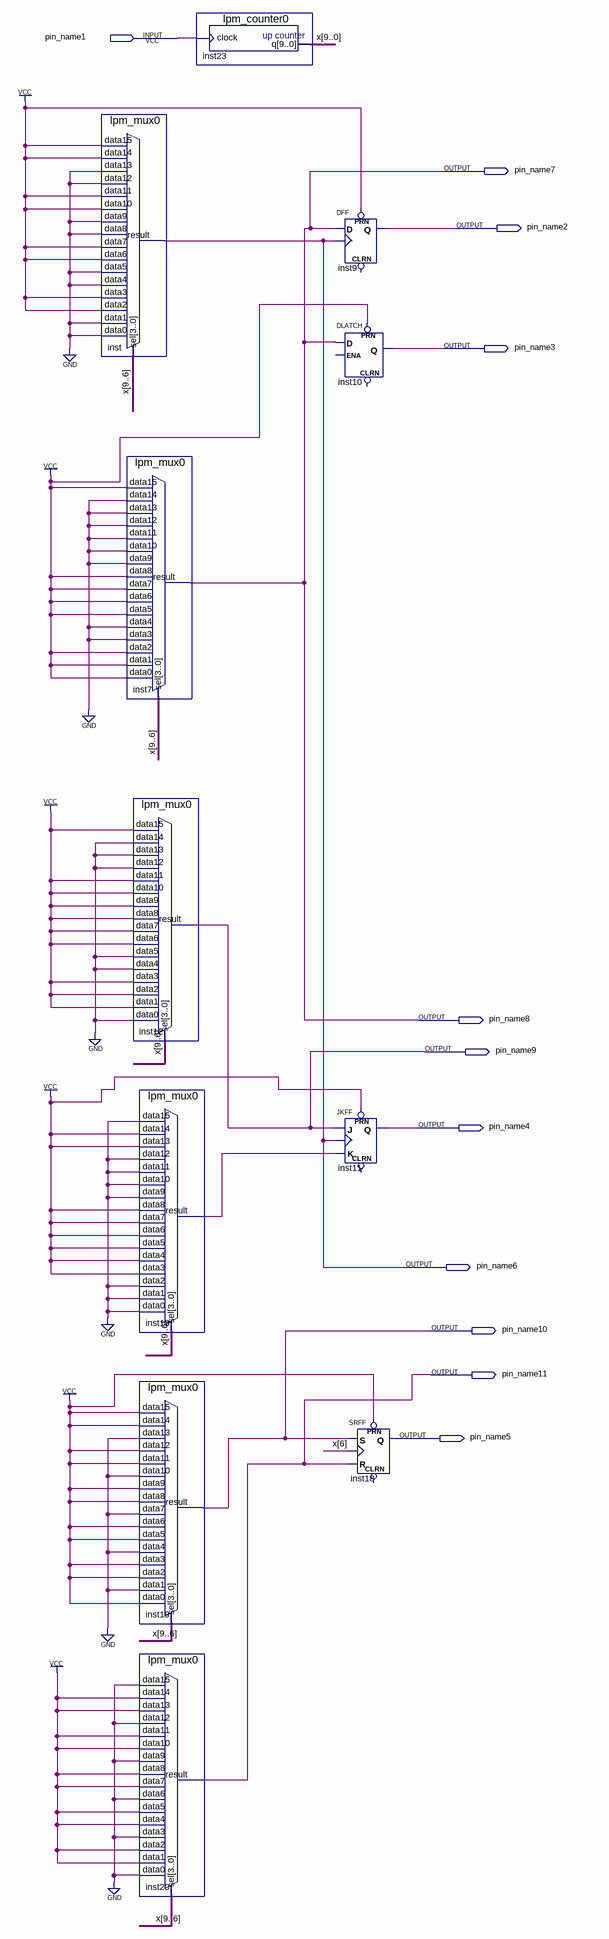
[diagram p0: schematic sheet]
// Quartus schematic Lab_4.bdf as structural Verilog: 11 symbols, 11 pins
module Lab_4 (
  input  pin_name1,
  output pin_name7,
  output pin_name2,
  output pin_name3,
  output pin_name8,
  output pin_name9,
  output pin_name4,
  output pin_name6,
  output pin_name10,
  output pin_name11,
  output pin_name5
);

  wire inst13_result;
  wire [9:0] x;

  lpm_mux0 inst (
    .data15(1'b1), .data14(1'b1), .data13(1'b0), .data12(1'b0), .data11(1'b1), .data10(1'b1), .data9(1'b0),
    .data8(1'b0), .data7(1'b1), .data6(1'b1), .data5(1'b0), .data4(1'b0), .data3(1'b1), .data2(1'b1),
    .data1(1'b0), .data0(1'b0), .sel(x[9:6]), .result(pin_name6));
  lpm_mux0 inst7 (
    .data15(1'b1), .data14(1'b0), .data13(1'b0), .data12(1'b0), .data11(1'b0), .data10(1'b0), .data9(1'b0),
    .data8(1'b1), .data7(1'b1), .data6(1'b1), .data5(1'b1), .data4(1'b0), .data3(1'b0), .data2(1'b1),
    .data1(1'b1), .data0(1'b1), .sel(x[9:6]), .result(pin_name7));
  lpm_mux0 inst12 (
    .data15(1'b1), .data14(1'b0), .data13(1'b0), .data12(1'b0), .data11(1'b1), .data10(1'b1), .data9(1'b1),
    .data8(1'b1), .data7(1'b1), .data6(1'b1), .data5(1'b0), .data4(1'b0), .data3(1'b1), .data2(1'b1),
    .data1(1'b1), .data0(1'b0), .sel(x[9:6]), .result(pin_name9));
  lpm_mux0 inst13 (
    .data15(1'b0), .data14(1'b1), .data13(1'b1), .data12(1'b0), .data11(1'b0), .data10(1'b0), .data9(1'b0),
    .data8(1'b1), .data7(1'b1), .data6(1'b1), .data5(1'b1), .data4(1'b1), .data3(1'b1), .data2(1'b0),
    .data1(1'b0), .data0(1'b0), .sel(x[9:6]), .result(inst13_result));
  lpm_mux0 inst19 (
    .data15(1'b1), .data14(1'b1), .data13(1'b0), .data12(1'b1), .data11(1'b1), .data10(1'b0), .data9(1'b1),
    .data8(1'b1), .data7(1'b0), .data6(1'b1), .data5(1'b1), .data4(1'b0), .data3(1'b1), .data2(1'b1),
    .data1(1'b0), .data0(1'b1), .sel(x[9:6]), .result(pin_name10));
  lpm_mux0 inst20 (
    .data15(1'b0), .data14(1'b1), .data13(1'b1), .data12(1'b0), .data11(1'b1), .data10(1'b1), .data9(1'b0),
    .data8(1'b1), .data7(1'b1), .data6(1'b0), .data5(1'b1), .data4(1'b1), .data3(1'b0), .data2(1'b1),
    .data1(1'b1), .data0(1'b0), .sel(x[9:6]), .result(pin_name11));
  lpm_counter0 inst23 (.clock(pin_name1), .q(x));
  DFF inst9 (.CLK(pin_name6), .D(pin_name7), .PRN(1'b1), .Q(pin_name2));  // open: CLRN
  DLATCH inst10 (.D(pin_name7), .PRN(1'b1), .Q(pin_name3));  // open: CLRN, ENA
  JKFF inst11 (.PRN(1'b1), .K(inst13_result), .J(pin_name9), .CLK(pin_name6), .Q(pin_name4));  // open: CLRN
  SRFF inst18 (.PRN(1'b1), .S(pin_name10), .R(pin_name11), .CLK(x[6]), .Q(pin_name5));  // open: CLRN

  assign pin_name8 = pin_name7;
endmodule
